# EAGLE design Register (EAGLE 9.6.2)
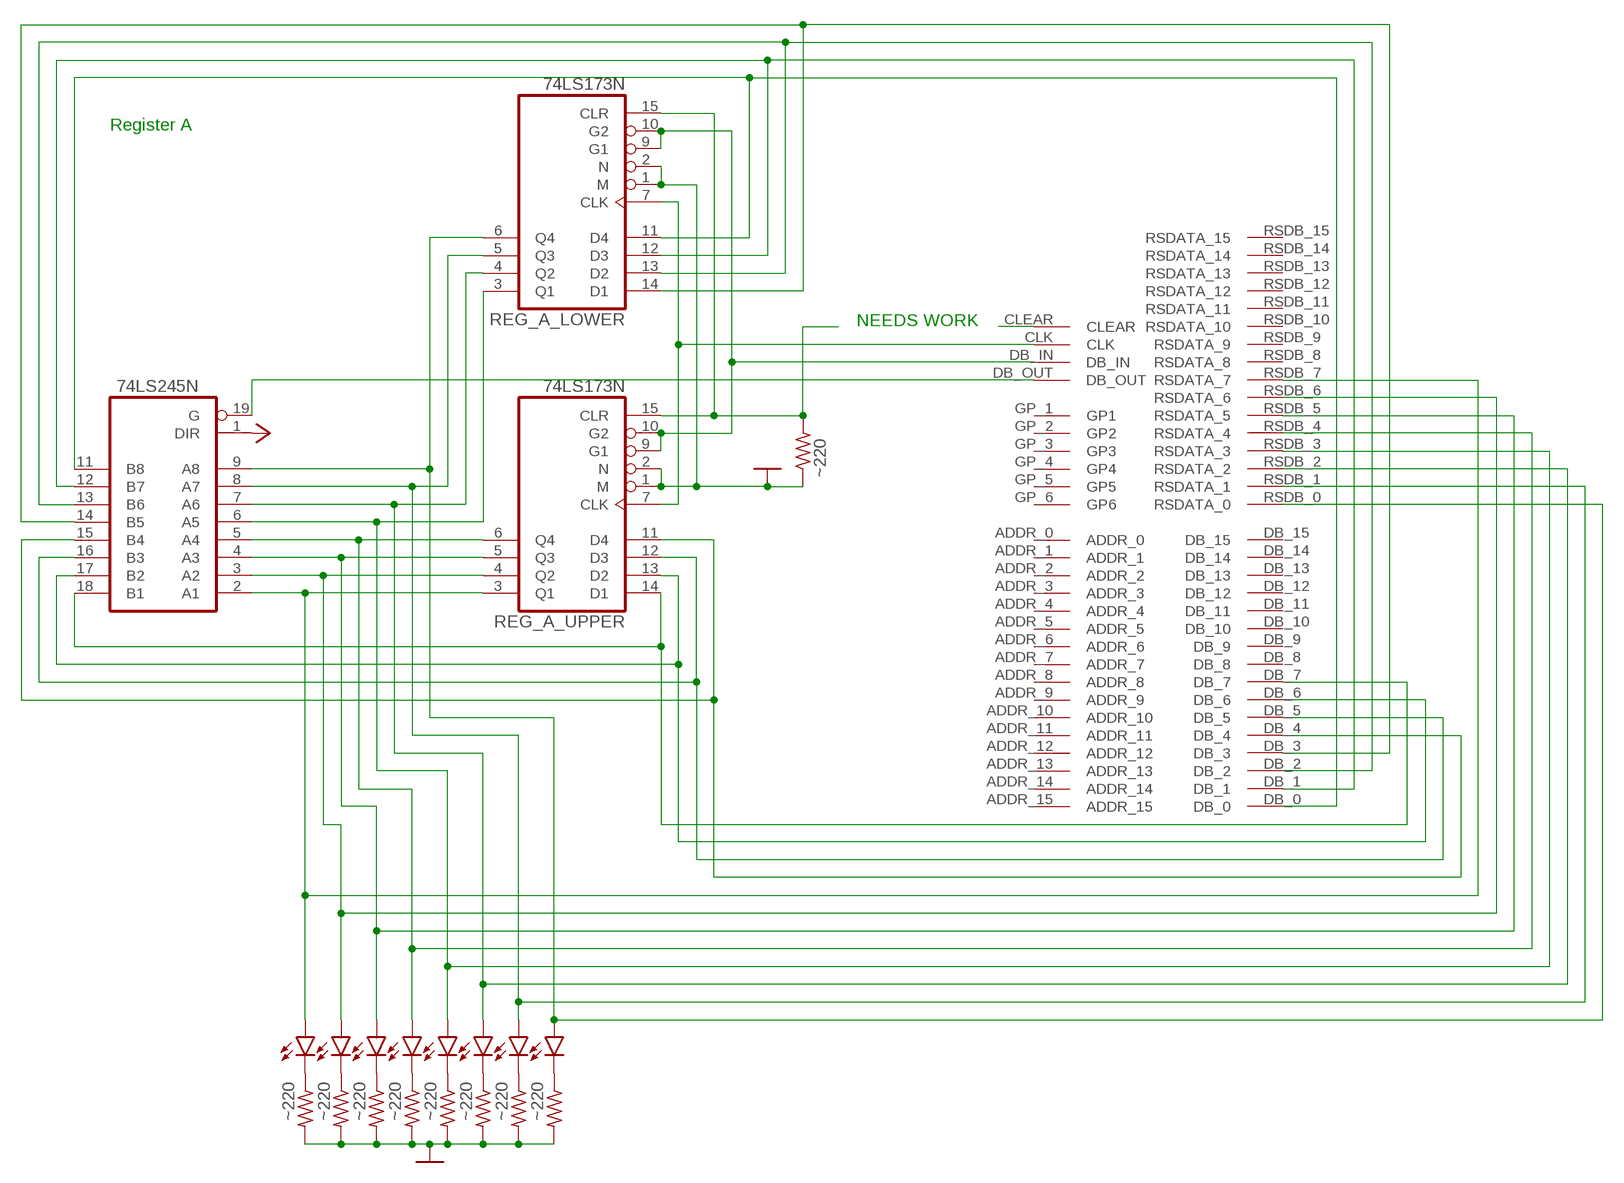
[diagram p0: schematic, sheet 1]

## Parts
LED_A_REG_1  LED  LED5MM  [LED5MM]
LED_A_REG_2  LED  LED5MM  [LED5MM]
LED_A_REG_3  LED  LED5MM  [LED5MM]
LED_A_REG_4  LED  LED5MM  [LED5MM]
LED_A_REG_5  LED  LED5MM  [LED5MM]
LED_A_REG_6  LED  LED5MM  [LED5MM]
LED_A_REG_7  LED  LED5MM  [LED5MM]
LED_A_REG_8  LED  LED5MM  [LED5MM]
OUTPUT_BUFFER_REG_A  74LS245N  [DIL20]
R1  ~220  R-US_0204/7  [0204/7]
R2  ~220  R-US_0204/7  [0204/7]
R3  ~220  R-US_0204/7  [0204/7]
R4  ~220  R-US_0204/7  [0204/7]
R5  ~220  R-US_0204/7  [0204/7]
R6  ~220  R-US_0204/7  [0204/7]
R7  ~220  R-US_0204/7  [0204/7]
R8  ~220  R-US_0204/7  [0204/7]
R9  ~220  R-US_0204/7  [0204/7]
REG_A_LOWER  74LS173N  [DIL16]
REG_A_UPPER  74LS173N  [DIL16]
U$1  BACKPLATE_INTERFACE  [BACK_INTERFACE-FOOT]

## Nets
1_PLACE1 [Databus]: OUTPUT_BUFFER_REG_A.11(B8) REG_A_LOWER.11(D4) U$1.DB_0
2_PLACE [Databus]: OUTPUT_BUFFER_REG_A.12(B7) REG_A_LOWER.12(D3) U$1.DB_1
4_PLACE [Databus]: OUTPUT_BUFFER_REG_A.13(B6) REG_A_LOWER.13(D2) U$1.DB_2
8_PLACE [Databus]: OUTPUT_BUFFER_REG_A.14(B5) REG_A_LOWER.14(D1) U$1.DB_3
16_PLACE [Databus]: OUTPUT_BUFFER_REG_A.15(B4) REG_A_UPPER.11(D4) U$1.DB_4
32_PLACE [Databus]: OUTPUT_BUFFER_REG_A.16(B3) REG_A_UPPER.12(D3) U$1.DB_5
64_PLACE [Databus]: OUTPUT_BUFFER_REG_A.17(B2) REG_A_UPPER.13(D2) U$1.DB_6
128_PLACE [Databus]: OUTPUT_BUFFER_REG_A.18(B1) REG_A_UPPER.14(D1) U$1.DB_7
CLOCK: REG_A_LOWER.7(CLK) REG_A_UPPER.7(CLK) U$1.CLK
GND: R1.2 R2.2 R3.2 R4.2 R5.2 R6.2 R7.2 R8.2 R9.1 REG_A_LOWER.1(M) REG_A_LOWER.2(N) REG_A_UPPER.1(M) REG_A_UPPER.2(N)
IN_SIGNAL: REG_A_LOWER.9(G1) REG_A_LOWER.10(G2) REG_A_UPPER.9(G1) REG_A_UPPER.10(G2) U$1.DB_IN
N$1: U$1.CLEAR
N$2: LED_A_REG_1.K(C) R1.1
N$4: R9.2 REG_A_LOWER.15(CLR) REG_A_UPPER.15(CLR)
N$120: LED_A_REG_2.K(C) R2.1
N$121: LED_A_REG_3.K(C) R3.1
N$122: LED_A_REG_4.K(C) R4.1
N$123: LED_A_REG_5.K(C) R5.1
N$124: LED_A_REG_6.K(C) R6.1
N$169: LED_A_REG_7.K(C) R7.1
N$176: LED_A_REG_8.K(C) R8.1
OUT_SIGNAL: OUTPUT_BUFFER_REG_A.19(G) U$1.DB_OUT
REG_A_1PLACE: LED_A_REG_1.A OUTPUT_BUFFER_REG_A.9(A8) REG_A_LOWER.6(Q4) U$1.RSDB_0(RSDATA_0)
REG_A_2PLACE: LED_A_REG_2.A OUTPUT_BUFFER_REG_A.8(A7) REG_A_LOWER.5(Q3) U$1.RSDB_1(RSDATA_1)
REG_A_4PLACE: LED_A_REG_3.A OUTPUT_BUFFER_REG_A.7(A6) REG_A_LOWER.4(Q2) U$1.RSDB_2(RSDATA_2)
REG_A_8PLACE: LED_A_REG_4.A OUTPUT_BUFFER_REG_A.6(A5) REG_A_LOWER.3(Q1) U$1.RSDB_3(RSDATA_3)
REG_A_16PLACE: LED_A_REG_5.A OUTPUT_BUFFER_REG_A.5(A4) REG_A_UPPER.6(Q4) U$1.RSDB_4(RSDATA_4)
REG_A_32PLACE: LED_A_REG_6.A OUTPUT_BUFFER_REG_A.4(A3) REG_A_UPPER.5(Q3) U$1.RSDB_5(RSDATA_5)
REG_A_64PLACE: LED_A_REG_7.A OUTPUT_BUFFER_REG_A.3(A2) REG_A_UPPER.4(Q2) U$1.RSDB_6(RSDATA_6)
REG_A_128PLACE: LED_A_REG_8.A OUTPUT_BUFFER_REG_A.2(A1) REG_A_UPPER.3(Q1) U$1.RSDB_7(RSDATA_7)
VCC: OUTPUT_BUFFER_REG_A.1(DIR)
Unconnected: U$1.ADDR_0 U$1.ADDR_1 U$1.ADDR_2 U$1.ADDR_3 U$1.ADDR_4 U$1.ADDR_5 U$1.ADDR_6 U$1.ADDR_7 U$1.ADDR_8 U$1.ADDR_9 U$1.ADDR_10 U$1.ADDR_11 U$1.ADDR_12 U$1.ADDR_13 U$1.ADDR_14 U$1.ADDR_15 U$1.DB_8 U$1.DB_9 U$1.DB_10 U$1.DB_11 U$1.DB_12 U$1.DB_13 U$1.DB_14 U$1.DB_15 U$1.GP_1(GP1) U$1.GP_2(GP2) U$1.GP_3(GP3) U$1.GP_4(GP4) U$1.GP_5(GP5) U$1.GP_6(GP6) U$1.NC_0 U$1.NC_1 U$1.RSDB_8(RSDATA_8) U$1.RSDB_9(RSDATA_9) U$1.RSDB_10(RSDATA_10) U$1.RSDB_11(RSDATA_11) U$1.RSDB_12(RSDATA_12) U$1.RSDB_13(RSDATA_13) U$1.RSDB_14(RSDATA_14) U$1.RSDB_15(RSDATA_15)

## Notes on the sheet
- Register A
- NEEDS WORK

## Power pins joined to a net without a drawn wire
GND: OUTPUT_BUFFER_REG_A.10(GND) REG_A_LOWER.8(GND) REG_A_UPPER.8(GND) U$1.GND U$1.GND2(GND)
VCC: OUTPUT_BUFFER_REG_A.20(VCC) REG_A_LOWER.16(VCC) REG_A_UPPER.16(VCC) U$1.VCC U$1.VCC2(VCC)

## Library data of the parts
LED_A_REG_1-LED_A_REG_8 = led:LED: LED OSRAM: - CHIPLED LG R971, LG N971, LY N971, LG Q971, LY Q971, LO R971, LY R971 LH N974, LH R974 LS Q976, LO Q976, LY Q976 LO Q996 - Hyper CHIPLED LW Q18S LB Q993, LB Q99A, LB R99A - SideLED LS A670, LO A670, LY A670, LG A670, LP A670 LB A673, LV A673, LT A673, LW A673 LH A674 LY A675 LS A676, LA A676, LO A676, LY A676, LW A676 LS A679, LY A679, LG A679 - Hyper Micro SIDELED® LS Y876, LA Y876, LO Y876, LY Y876 LT Y87S - SmartLED LW L88C, LW L88S LB L89C, LB L89S, LG L890 LS L89K, LO L89K, LY L89K LS L896, LA L896, LO L896, LY L896 - TOPLED LS T670, LO T670, LY T670, LG T670, LP T670 LSG T670, LSP T670, LSY T670, LOP T670, LYG T670 LG T671, LOG T671, LSG T671 LB T673, LV T673, LT T673, LW T673 LH T674 LS T676, LA T676, LO T676, LY T676, LB T676, LH T676, LSB T676, LW T676 LB T67C, LV T67C, LT T67C, LS T67K, LO T67K, LY T67K, LW E67C LS E67B, LA E67B, LO E67B, LY E67B, LB E67C, LV E67C, LT E67C LW T67C LS T679, LY T679, LG T679 LS T770, LO T770, LY T770, LG T770, LP T770 LB T773, LV T773, LT T773, LW T773 LH T774 LS E675, LA E675, LY E675, LS T675 LS T776, LA T776, LO T776, LY T776, LB T776 LHGB T686 LT T68C, LB T68C - Hyper Mini TOPLED® LB M676 - Mini TOPLED Santana® LG M470 LS M47K, LO M47K, LY M47K Source: http://www.osram.convergy.de LUXEON: - LUMILED® LXK2-PW12-R00, LXK2-PW12-S00, LXK2-PW14-U00, LXK2-PW14-V00 LXK2-PM12-R00, LXK2-PM12-S00, LXK2-PM14-U00 LXK2-PE12-Q00, LXK2-PE12-R00, LXK2-PE12-S00, LXK2-PE14-T00, LXK2-PE14-U00 LXK2-PB12-K00, LXK2-PB12-L00, LXK2-PB12-M00, LXK2-PB14-N00, LXK2-PB14-P00, LXK2-PB14-Q00 LXK2-PR12-L00, LXK2-PR12-M00, LXK2-PR14-Q00, LXK2-PR14-R00 LXK2-PD12-Q00, LXK2-PD12-R00, LXK2-PD12-S00 LXK2-PH12-R00, LXK2-PH12-S00 LXK2-PL12-P00, LXK2-PL12-Q00, LXK2-PL12-R00 Source: www.luxeon.com KINGBRIGHT: KA-3528ASYC Source: www.kingbright.com
OUTPUT_BUFFER_REG_A = 74xx-eu:74*245: Octal BUS TRANSCEIVER, 3-state
R1-R9 = rcl:R-US_: RESISTOR, American symbol; SPICEPREFIX: R
REG_A_LOWER REG_A_UPPER = 74xx-eu:74*173: 4-bit D type REGISTER, 3-state
U$1 = Computer:BACKPLATE_INTERFACE

## Board
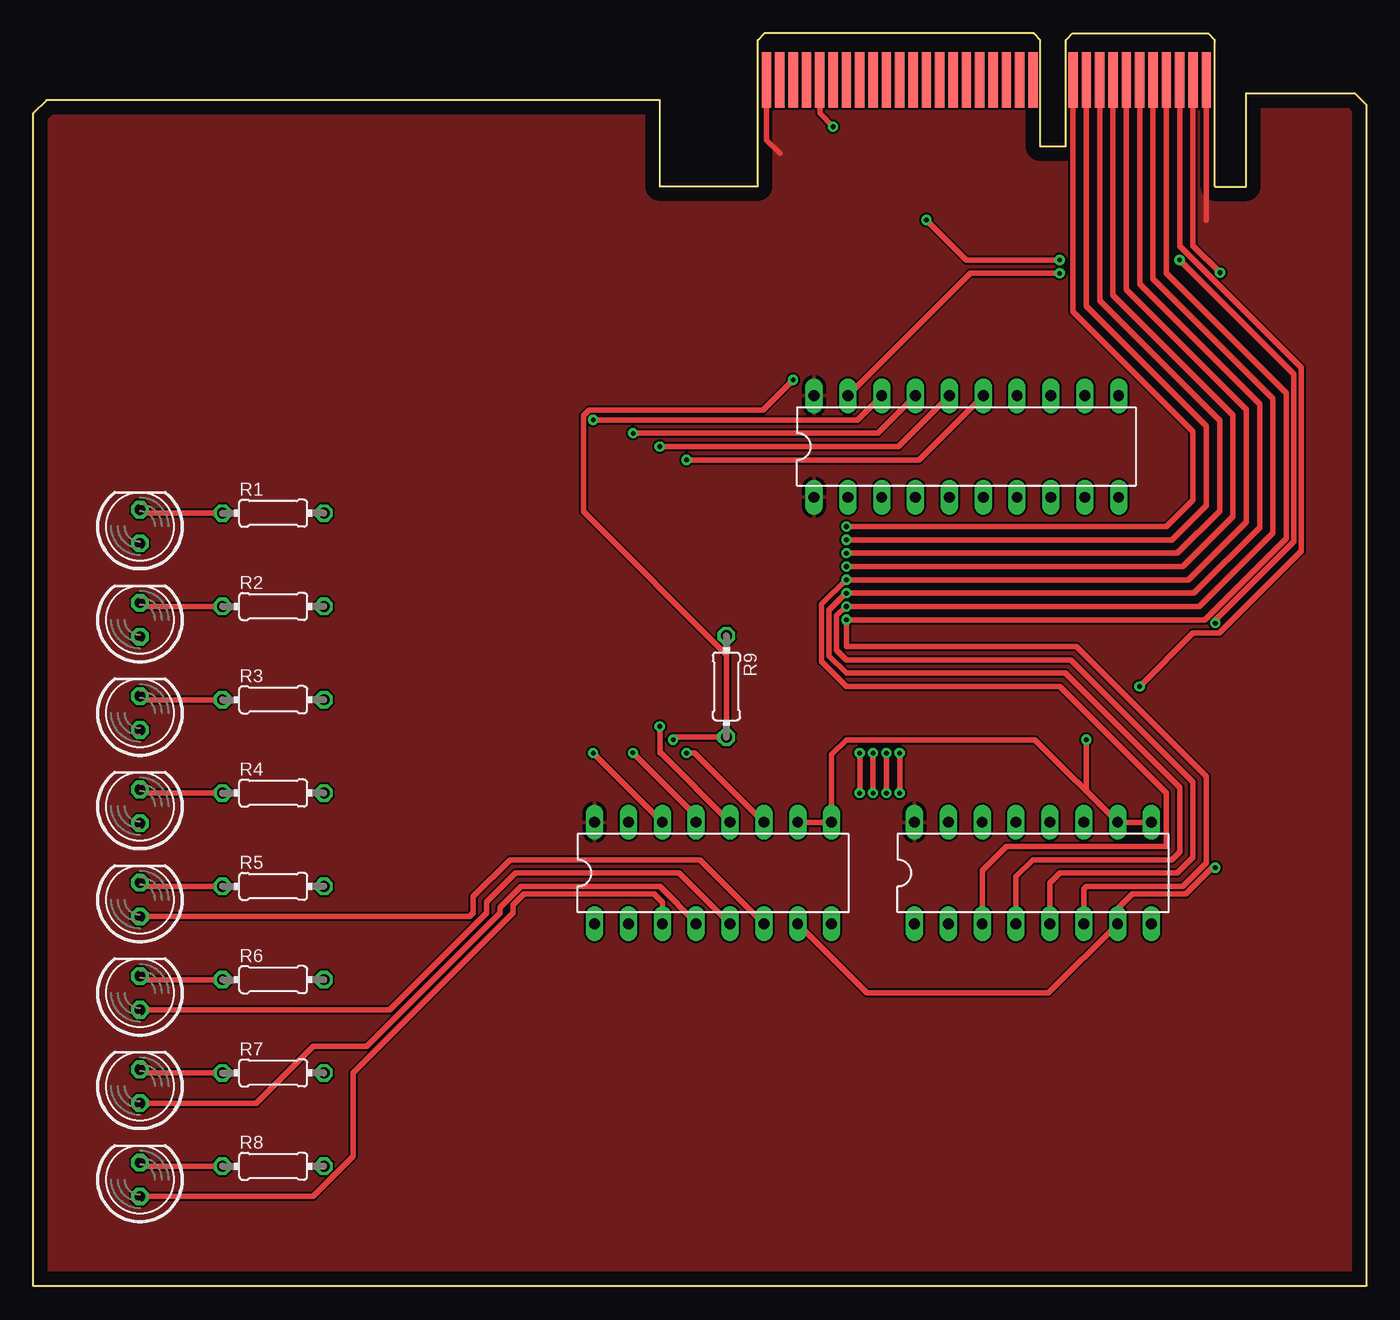
[diagram p1: board, top side]
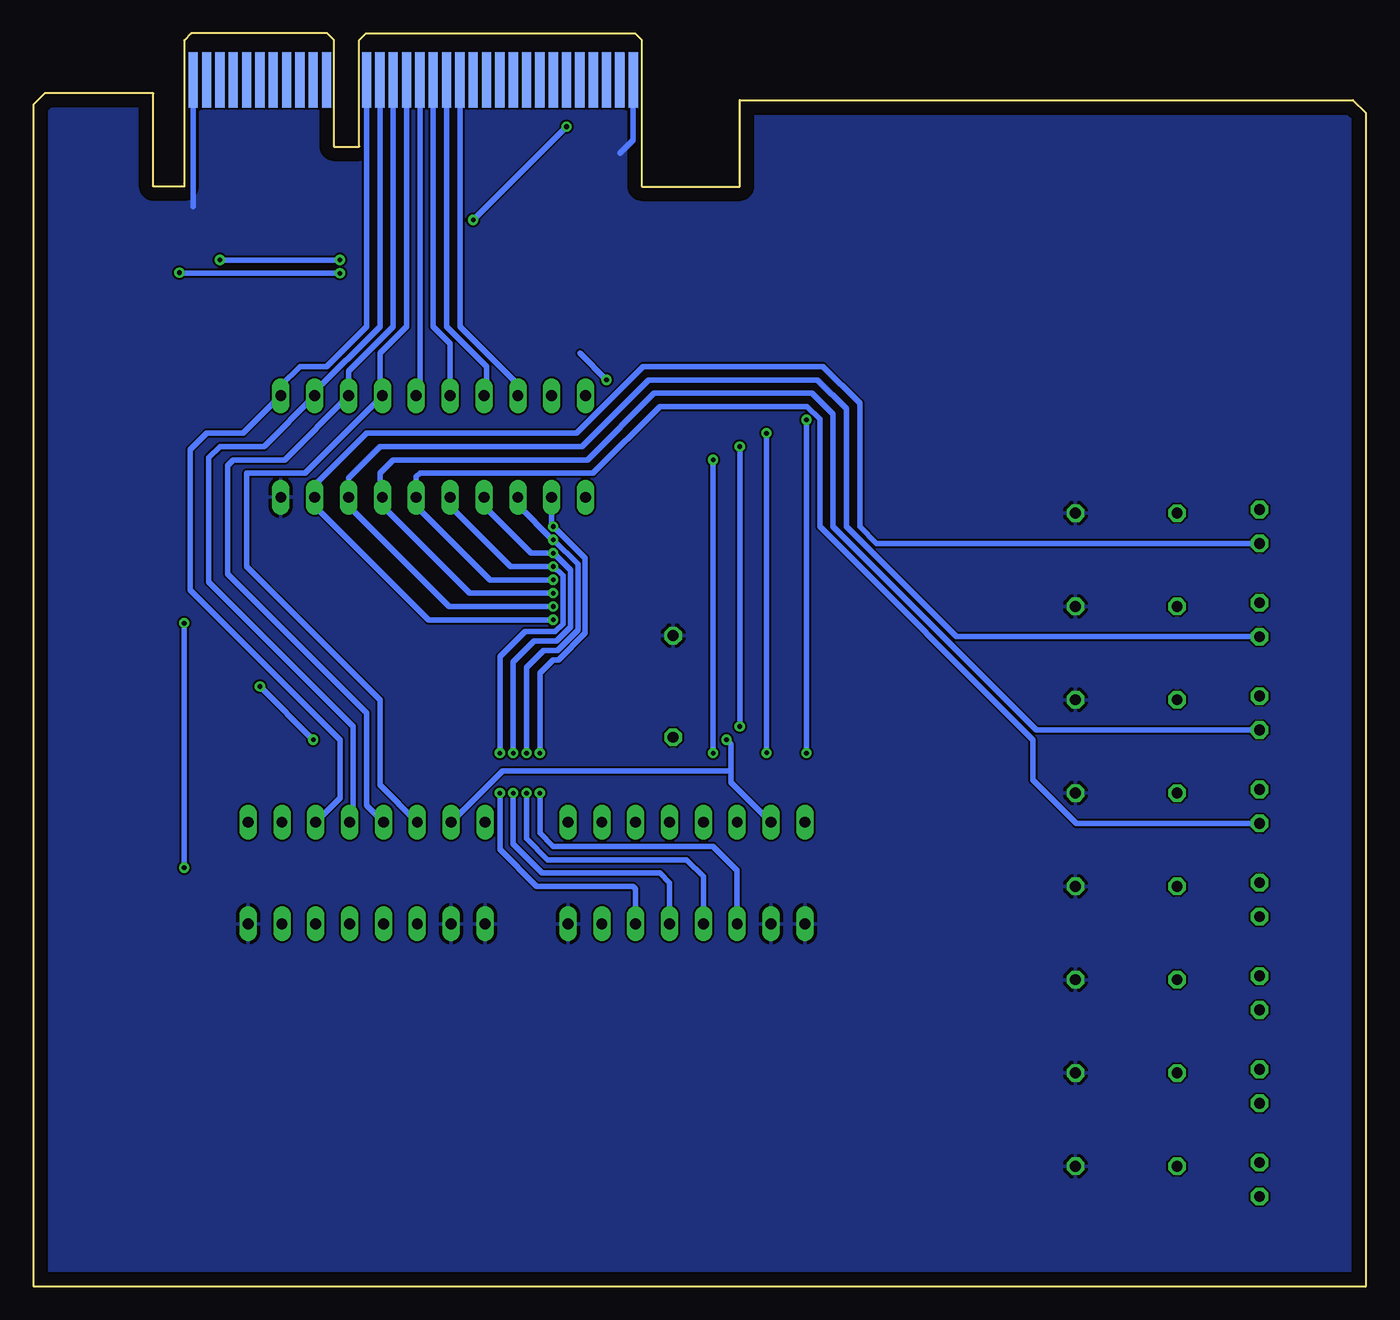
[diagram p2: board, bottom side, seen from below]

Size 100 x 94 mm. Coordinates in mm from the lower left corner, seen from the top.
Outline: 0,0 0,88 1,89 47,89 47,82.5 54.35,82.5 54.35,93.5 54.85,94 75.05,94 75.55,93.5 75.55,85.5 77.45,85.5 77.45,93.5 77.95,94 88.15,94 88.65,93.5 88.65,82.5 91,82.5 91,89.5 99.15,89.5 100,88.65 100,0 0,0
Copper layers (1*16): Top 0.035mm / dielectric 1.5mm / Bottom 0.035mm
Design rules "default": minimum track width 6mil, minimum drill 0.35mm, track to track 6mil, track to pad 6mil, pad to pad 6mil, via to via 6mil, smd to smd 6mil, copper to edge 40mil, drill to drill 6mil, minimum pad ring 10mil, minimum via ring 8mil, stop-mask expansion 4mil, vias tented up to drill 0mil, thermal gap 10mil

### Footprints (pad centres in the part's own frame; a part is rotated, then mirrored left to right if it is on the bottom)
LED5MM = drill 0.813 octagon: A -1.27,0; K 1.27,0
DIL20 = drill 0.813 long: 1 -11.43,-3.81; 2 -8.89,-3.81; 3 -6.35,-3.81; 4 -3.81,-3.81; 5 -1.27,-3.81; 6 1.27,-3.81; 7 3.81,-3.81; 8 6.35,-3.81; 9 8.89,-3.81; 10 11.43,-3.81; 11 11.43,3.81; 12 8.89,3.81; 13 6.35,3.81; 14 3.81,3.81; 15 1.27,3.81; 16 -1.27,3.81; 17 -3.81,3.81; 18 -6.35,3.81; 19 -8.89,3.81; 20 -11.43,3.81
0204/7 = drill 0.813 octagon: 1 -3.81,0; 2 3.81,0
DIL16 = drill 0.813 long: 1 -8.89,-3.81; 2 -6.35,-3.81; 3 -3.81,-3.81; 4 -1.27,-3.81; 5 1.27,-3.81; 6 3.81,-3.81; 7 6.35,-3.81; 8 8.89,-3.81; 9 8.89,3.81; 10 6.35,3.81; 11 3.81,3.81; 12 1.27,3.81; 13 -1.27,3.81; 14 -3.81,3.81; 15 -6.35,3.81; 16 -8.89,3.81
BACK_INTERFACE-FOOT = smd 0.7 x 4.2: ADDR_0 13,0; ADDR_1 14,0; ADDR_2 15,0; ADDR_3 16,0; ADDR_4 17,0; ADDR_5 18,0; ADDR_6 19,0; ADDR_7 20,0; ADDR_8 21,0; ADDR_9 22,0; ADDR_10 23,0; ADDR_11 24,0; ADDR_12 25,0; ADDR_13 26,0; ADDR_14 27,0; ADDR_15 28,0; CLK 29,0; DB_IN 2,0; DB_OUT 1,0; GP_1 32,0; GP_2 31,0; GP_3 30,0; RSDB_0 3,0; RSDB_1 4,0; RSDB_2 5,0; RSDB_3 6,0; RSDB_4 7,0; RSDB_5 8,0; RSDB_6 9,0; RSDB_7 10,0; VCC 0,0; VCC2 33,0 | smd 0.7 x 4.2 bottom: CLEAR 29,0; DB_0 13,0; DB_1 14,0; DB_2 15,0; DB_3 16,0; DB_4 17,0; DB_5 18,0; DB_6 19,0; DB_7 20,0; DB_8 21,0; DB_9 22,0; DB_10 23,0; DB_11 24,0; DB_12 25,0; DB_13 26,0; DB_14 27,0; DB_15 28,0; GND 0,0; GND2 33,0; GP_4 32,0; GP_5 31,0; GP_6 30,0; NC_0 1,0; NC_1 2,0; RSDB_8 3,0; RSDB_9 4,0; RSDB_10 5,0; RSDB_11 6,0; RSDB_12 7,0; RSDB_13 8,0; RSDB_14 9,0; RSDB_15 10,0

### Placement (x,y rotation side)
LED_A_REG_1  8,57 90 top
LED_A_REG_2  8,50 90 top
LED_A_REG_3  8,43 90 top
LED_A_REG_4  8,36 90 top
LED_A_REG_5  8,29 90 top
LED_A_REG_6  8,22 90 top
LED_A_REG_7  8,15 90 top
LED_A_REG_8  8,8 90 top
OUTPUT_BUFFER_REG_A  70,63 0 top
R1  18,58 0 top
R2  18,51 0 top
R3  18,44 0 top
R4  18,37 0 top
R5  18,30 0 top
R6  18,23 0 top
R7  18,16 0 top
R8  18,9 0 top
R9  52,45 270 top
REG_A_LOWER  75,31 0 top
REG_A_UPPER  51,31 0 top
U$1  88,90.5 180 top

### Tracks (layer width: path | path; a pad name or v marks a point on that pad's centre or on a via)
1_PLACE1
  Bottom 0.406: U$1.DB_0 75,72 78,69 80,69 81.43,67.57 OUTPUT_BUFFER_REG_A.11 84.24,64 87,64 88.24,62.76 88.24,52.24 77,41 77,36.62 REG_A_LOWER.11
2_PLACE
  Bottom 0.406: U$1.DB_1 74,72 79,67 79,66.92 OUTPUT_BUFFER_REG_A.12 82.7,63 86,63 86.83,62.17 86.83,52.83 76,42 76,35.08 REG_A_LOWER.12
4_PLACE
  Bottom 0.406: U$1.DB_2 73,72 76.35,68.65 OUTPUT_BUFFER_REG_A.13 81.16,62 85,62 85.41,61.59 85.41,53.41 75,43 75,36.08 REG_A_LOWER.13
8_PLACE
  Bottom 0.406: U$1.DB_3 72,72 74,70 74,67 OUTPUT_BUFFER_REG_A.14 79.62,61 84,61 84,54 74,44 74,37.62 REG_A_LOWER.14
16_PLACE  (via drill 0.35)
  Top 0.406: REG_A_UPPER.11 49.62,40 v49,40 | OUTPUT_BUFFER_REG_A.15 66.46,62 v49,62
  Bottom 0.406: U$1.DB_4 71,67.08 OUTPUT_BUFFER_REG_A.15 | v49,62 49,46 49,45.63 v49,40
32_PLACE  (via drill 0.35)
  Top 0.406: REG_A_UPPER.12 47.08,40 | 47.08,40 47,40 | OUTPUT_BUFFER_REG_A.16 64.92,63 v47,63 | v47,42 47,40.08 47.08,40
  Bottom 0.406: OUTPUT_BUFFER_REG_A.16 68.73,70.73 70,72 U$1.DB_5 | v47,63 v47,42
64_PLACE  (via drill 0.35)
  Top 0.406: REG_A_UPPER.13 49.73,35.27 v44.98,40.02 | OUTPUT_BUFFER_REG_A.17 63.38,64 v45,64
  Bottom 0.406: U$1.DB_6 69,72 66,69 66,67 OUTPUT_BUFFER_REG_A.17 | v44.98,40.02 44.98,63.98 v45,64
128_PLACE  (via drill 0.35)
  Top 0.406: REG_A_UPPER.14 v42,40 | OUTPUT_BUFFER_REG_A.18 61.84,65 v42,65
  Bottom 0.406: U$1.DB_7 68,72 63.65,67.65 OUTPUT_BUFFER_REG_A.18 | v42,65 v42,40
CLOCK  (via drill 0.35)
  Top 0.406: REG_A_UPPER.7 62.54,22 76.16,22 REG_A_LOWER.7 81.35,28.35 82.44,29.44 86.47,29.44 88.56,31.53 v88.68,31.4 | v86,77 94.56,68.44 94.56,55.87 88.56,49.87 v88.68,49.74 | v67,80 70,77 v77,77 | v60,87 59,88 U$1.CLK
  Bottom 0.406: v77,77 v86,77 | v60,87 v67,80 | v88.68,49.74 v88.68,31.4
GND
  Bottom 0.406: U$1.GND 88,81 | U$1.GND2 55,86 56,85
  pour Bottom: 0,0 0,88 1,89 47,89 47,82.5 54.35,82.5 54.35,93.5 54.85,94 75.05,94 75.55,93.5 75.55,85.5 77.45,85.5 77.45,93.5 77.95,94 88.15,94 88.65,93.5 88.65,82.5 91,82.5 91,89.5 99.15,89.5 100,88.65 100,0
IN_SIGNAL  (via drill 0.35)
  Top 0.406: REG_A_LOWER.9 REG_A_LOWER.10 | REG_A_UPPER.10 REG_A_UPPER.9 59.89,39.89 61,41 75.16,41 REG_A_LOWER.10 | U$1.DB_IN 86,78.04 95.12,68.92 95.12,55.14 88.99,49.01 87.01,49.01 v83,45 | v79,41 79,37.16 REG_A_LOWER.10
  Bottom 0.406: v83,45 v79,41
N$2
  Top 0.406: R1.1 8.27,58 LED_A_REG_1.K
N$4  (via drill 0.35)
  Top 0.406: v48,41 48.19,41.19 R9.2 52,47.37 41.27,58.11 41.27,65.3 41.7,65.73 54.73,65.73 v57,68
  Bottom 0.406: 47.65,38.65 47.65,37.81 REG_A_UPPER.15 | REG_A_LOWER.15 64.81,38.65 47.65,38.65 | 47.65,38.65 47.65,40.65 v48,41 | v57,68 59,70
N$120
  Top 0.406: R2.1 8.27,51 LED_A_REG_2.K
N$121
  Top 0.406: R3.1 8.27,44 LED_A_REG_3.K
N$122
  Top 0.406: R4.1 8.27,37 LED_A_REG_4.K
N$123
  Top 0.406: R5.1 8.27,30 LED_A_REG_5.K
N$124
  Top 0.406: R6.1 8.27,23 LED_A_REG_6.K
N$169
  Top 0.406: R7.1 8.27,16 LED_A_REG_7.K
N$176
  Top 0.406: R8.1 8.27,9 LED_A_REG_8.K
OUT_SIGNAL  (via drill 0.35)
  Top 0.406: U$1.DB_OUT 87,78.08 v89.04,76.04 | v77,76 70.3,76 OUTPUT_BUFFER_REG_A.19
  Bottom 0.406: v89.04,76.04 89,76 v77,76
REG_A_1PLACE  (via drill 0.35)
  Top 0.406: REG_A_LOWER.6 78.81,29.81 79,30 86.24,30 88,31.76 88,38.24 78.24,48 61,48 v61,50 87.9,50 94,56.1 94,67 85,76 U$1.RSDB_0
  Bottom 0.406: LED_A_REG_1.A 36.73,55.73 38,57 38,66.24 40.76,69 54.24,69 59.24,64 75,64 79,60 79,59.3 OUTPUT_BUFFER_REG_A.9 78.89,58.53 70.36,50 v61,50
REG_A_2PLACE  (via drill 0.35)
  Top 0.406: REG_A_LOWER.5 76.27,30.27 77,31 85.83,31 87,32.17 87,37.83 77.83,47 61,47 60.27,47.73 60.27,50.3 60.96,51 v61,51 87.48,51 93,56.52 93,66.59 84,75.59 U$1.RSDB_1 | 76.35,58.65 OUTPUT_BUFFER_REG_A.8
  Bottom 0.406: LED_A_REG_2.A 30.73,48.73 39,57 39,65.83 41.17,68 53.83,68 58.83,63 74,63 76.35,60.65 OUTPUT_BUFFER_REG_A.8 76.35,58.53 68.82,51 v61,51
REG_A_4PLACE  (via drill 0.35)
  Top 0.406: REG_A_LOWER.4 73.73,30.73 75,32 85.41,32 86,32.59 86,37.41 77.41,46 61,46 59.71,47.29 59.71,50.74 60.96,52 v61,52 87.07,52 92,56.93 92,66.17 83,75.17 U$1.RSDB_2
  Bottom 0.406: LED_A_REG_3.A 24.73,41.73 40,57 40,65.41 41.59,67 53.41,67 58.41,62 73,62 74,61 74,59.38 OUTPUT_BUFFER_REG_A.7 73.81,58.53 67.28,52 v61,52
REG_A_8PLACE  (via drill 0.35)
  Top 0.406: REG_A_LOWER.3 71.19,31.19 73,33 85,33 85,37 77,45 61,45 59.15,46.85 59.15,51.19 60.96,53 v61,53 86.66,53 91,57.34 91,65.76 82,74.76 U$1.RSDB_3
  Bottom 0.406: LED_A_REG_4.A 21.73,34.73 25,38 25,41 41,57 41,65.04 41.96,66 53,66 58,61 71,61 71.27,60.73 OUTPUT_BUFFER_REG_A.6 71.27,58.53 65.74,53 v61,53
REG_A_16PLACE  (via drill 0.35)
  Top 0.406: LED_A_REG_5.A 32.73,27.73 33,28 33,29.24 35.76,32 50,32 REG_A_UPPER.6 | U$1.RSDB_4 81,74.34 90,65.34 90,57.76 86.24,54 v61,54 | v65,37 v65,40
  Bottom 0.406: OUTPUT_BUFFER_REG_A.5 68.73,58.53 64.2,54 v61,54 60.96,54 60.27,53.3 60.27,49.7 60.84,49.12 63.12,49.12 65,47.24 v65,40 | REG_A_UPPER.6 54.81,29.81 55,30 62.24,30 65,32.76 v65,37
REG_A_32PLACE  (via drill 0.35)
  Top 0.406: LED_A_REG_6.A 26.73,20.73 34,28 34,28.83 36.17,31 48.46,31 REG_A_UPPER.5 | U$1.RSDB_5 80,73.93 89,64.93 89,58.17 85.83,55 v61,55 | v64,37 v64,40
  Bottom 0.406: OUTPUT_BUFFER_REG_A.4 66.19,58.53 62.66,55 v61,55 60.96,55 59.71,53.74 59.71,49.47 60.76,48.41 62.41,48.41 64,46.83 v64,40 | REG_A_UPPER.5 52.27,30.27 53,31 61.83,31 64,33.17 v64,37
REG_A_64PLACE  (via drill 0.35)
  Top 0.406: REG_A_UPPER.4 49.73,27.27 47,30 36.59,30 35,28.41 35,28 25,18 21,18 16.73,13.73 LED_A_REG_7.A | U$1.RSDB_6 79,73.52 88,64.52 88,58.59 85.41,56 v61,56 | v63,37 v63,40
  Bottom 0.406: OUTPUT_BUFFER_REG_A.3 63.65,58.61 61.04,56 v61,56 60.96,56 59.15,54.19 59.15,49.23 60.67,47.71 61.71,47.71 63,46.41 v63,40 | REG_A_UPPER.4 49.73,30.73 51,32 61.41,32 63,33.59 v63,37
REG_A_128PLACE  (via drill 0.35)
  Top 0.406: LED_A_REG_8.A 21,6.73 24,9.73 24,16 36,28 36,28.62 36.82,29.44 46.56,29.44 47.19,28.81 REG_A_UPPER.3 | U$1.RSDB_7 78,73.1 87,64.1 87,59 85,57 v61,57 | v62,37 v62,40
  Bottom 0.406: OUTPUT_BUFFER_REG_A.2 61.11,57.11 v61,57 60.96,57 58.59,54.63 58.59,49 60.59,47 61,47 62,46 v62,40 | REG_A_UPPER.3 47.19,31.19 49,33 61,33 62,34 v62,37
VCC
  Top 0.406: U$1.VCC2 55,86 56,85 | U$1.VCC 88,80
  pour Top: 0,0 0,88 1,89 47,89 47,82.5 54.35,82.5 54.35,93.5 54.85,94 75.05,94 75.55,93.5 75.55,85.5 77.45,85.5 77.45,93.5 77.95,94 88.15,94 88.65,93.5 88.65,82.5 91,82.5 91,89.5 99.15,89.5 100,88.65 100,0